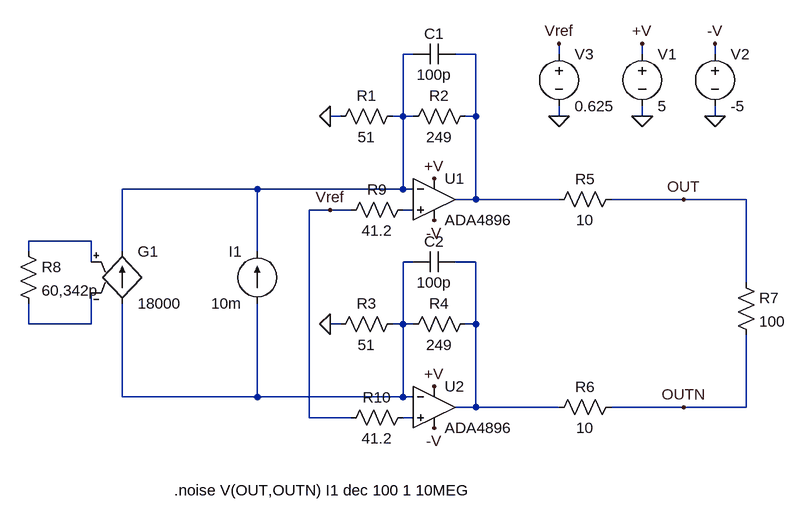
[diagram p0: schematic ADA4896.asc]
ADA4896.asc, the LTspice schematic file:
Version 4
SHEET 1 1240 700
WIRE 544 -1328 528 -1328
WIRE 640 -1328 608 -1328
WIRE 768 -1328 768 -1344
WIRE 896 -1328 896 -1344
WIRE 1008 -1328 1008 -1344
WIRE 432 -1232 416 -1232
WIRE 528 -1232 528 -1328
WIRE 528 -1232 512 -1232
WIRE 544 -1232 528 -1232
WIRE 640 -1232 640 -1328
WIRE 640 -1232 624 -1232
WIRE 768 -1232 768 -1248
WIRE 896 -1232 896 -1248
WIRE 1008 -1232 1008 -1248
WIRE 304 -1120 96 -1120
WIRE 528 -1120 528 -1232
WIRE 528 -1120 304 -1120
WIRE 544 -1120 528 -1120
WIRE 640 -1104 640 -1232
WIRE 640 -1104 608 -1104
WIRE 768 -1104 640 -1104
WIRE 960 -1104 848 -1104
WIRE 1056 -1104 960 -1104
WIRE 416 -1088 384 -1088
WIRE 448 -1088 416 -1088
WIRE 544 -1088 528 -1088
WIRE 48 -1040 -48 -1040
WIRE -48 -1024 -48 -1040
WIRE 96 -1024 96 -1120
WIRE 304 -1024 304 -1120
WIRE 48 -1008 48 -1040
WIRE 544 -1008 528 -1008
WIRE 640 -1008 608 -1008
WIRE 1056 -976 1056 -1104
WIRE -48 -912 -48 -944
WIRE 48 -912 48 -960
WIRE 48 -912 -48 -912
WIRE 432 -912 416 -912
WIRE 528 -912 528 -1008
WIRE 528 -912 512 -912
WIRE 544 -912 528 -912
WIRE 640 -912 640 -1008
WIRE 640 -912 624 -912
WIRE 96 -800 96 -944
WIRE 304 -800 304 -944
WIRE 304 -800 96 -800
WIRE 528 -800 528 -912
WIRE 528 -800 304 -800
WIRE 544 -800 528 -800
WIRE 640 -784 640 -912
WIRE 640 -784 608 -784
WIRE 768 -784 640 -784
WIRE 960 -784 848 -784
WIRE 1056 -784 1056 -896
WIRE 1056 -784 960 -784
WIRE 384 -768 384 -1088
WIRE 448 -768 384 -768
WIRE 544 -768 528 -768
FLAG 896 -1344 +V
FLAG 896 -1232 0
FLAG 576 -1136 +V
FLAG 1008 -1344 -V
FLAG 576 -1072 -V
FLAG 416 -1232 0
FLAG 1008 -1232 0
FLAG 576 -816 +V
FLAG 576 -752 -V
FLAG 416 -912 0
FLAG 768 -1232 0
FLAG 768 -1344 Vref
FLAG 416 -1088 Vref
FLAG 960 -1104 OUT
FLAG 960 -784 OUTN
SYMBOL voltage 896 -1344 R0
WINDOW 123 0 0 Left 2
WINDOW 39 0 0 Left 2
SYMATTR InstName V1
SYMATTR Value 5
SYMBOL res 528 -1248 R90
WINDOW 0 0 56 VBottom 2
WINDOW 3 32 56 VTop 2
SYMATTR InstName R1
SYMATTR Value 51
SYMBOL res 640 -1248 R90
WINDOW 0 0 56 VBottom 2
WINDOW 3 32 56 VTop 2
SYMATTR InstName R2
SYMATTR Value 249
SYMBOL Opamps\\ADA4896 576 -1168 R0
SYMATTR InstName U1
SYMBOL voltage 1008 -1344 R0
WINDOW 123 24 146 Left 2
WINDOW 39 24 125 Left 2
SYMATTR InstName V2
SYMATTR Value -5
SYMBOL res 528 -928 R90
WINDOW 0 0 56 VBottom 2
WINDOW 3 32 56 VTop 2
SYMATTR InstName R3
SYMATTR Value 51
SYMBOL res 640 -928 R90
WINDOW 0 0 56 VBottom 2
WINDOW 3 32 56 VTop 2
SYMATTR InstName R4
SYMATTR Value 249
SYMBOL Opamps\\ADA4896 576 -848 R0
SYMATTR InstName U2
SYMBOL voltage 768 -1344 R0
WINDOW 123 0 0 Left 2
WINDOW 39 0 0 Left 2
SYMATTR InstName V3
SYMATTR Value 0.625
SYMBOL res 864 -1120 R90
WINDOW 0 0 56 VBottom 2
WINDOW 3 32 56 VTop 2
SYMATTR InstName R5
SYMATTR Value 10
SYMBOL res 864 -800 R90
WINDOW 0 0 56 VBottom 2
WINDOW 3 32 56 VTop 2
SYMATTR InstName R6
SYMATTR Value 10
SYMBOL res 1040 -992 R0
SYMATTR InstName R7
SYMATTR Value 100
SYMBOL current 304 -944 R180
WINDOW 0 24 80 Left 2
WINDOW 3 24 0 Left 2
WINDOW 123 0 0 Left 0
WINDOW 39 0 0 Left 0
SYMATTR InstName I1
SYMATTR Value 10m
SYMBOL g 96 -1040 R0
SYMATTR InstName G1
SYMATTR Value 18000
SYMBOL res -64 -1040 R0
SYMATTR InstName R8
SYMATTR Value 60,342p
SYMBOL cap 608 -1344 R90
WINDOW 0 0 32 VBottom 2
WINDOW 3 32 32 VTop 2
SYMATTR InstName C1
SYMATTR Value 100p
SYMBOL cap 608 -1024 R90
WINDOW 0 0 32 VBottom 2
WINDOW 3 32 32 VTop 2
SYMATTR InstName C2
SYMATTR Value 100p
SYMBOL res 544 -1104 R90
WINDOW 0 0 56 VBottom 2
WINDOW 3 32 56 VTop 2
SYMATTR InstName R9
SYMATTR Value 41.2
SYMBOL res 544 -784 R90
WINDOW 0 0 56 VBottom 2
WINDOW 3 32 56 VTop 2
SYMATTR InstName R10
SYMATTR Value 41.2
TEXT 176 -656 Left 2 !.noise V(OUT,OUTN) I1 dec 100 1 10MEG

The netlist it stands for:
* ADA4896.asc
V1 +V 0 5
R1 N001 0 51
R2 N002 N001 249
XU1 N003 N001 +V -V N002 ADA4896  ; pins In+ In- V+ V- OUT
V2 -V 0 -5
R3 N005 0 51
R4 N006 N005 249
XU2 N008 N005 +V -V N006 ADA4896  ; pins In+ In- V+ V- OUT
V3 Vref 0 0.625
R5 OUT N002 10
R6 OUTN N006 10
R7 OUT OUTN 100
I1 N005 N001 10m
G1 N005 N001 N004 N007 18000
R8 N004 N007 60,342p
C1 N002 N001 100p
C2 N006 N005 100p
R9 N003 Vref 41.2
R10 N008 Vref 41.2
.noise V(OUT,OUTN) I1 dec 100 1 10MEG
.backanno
.end